# EAGLE design Sedna Power Board v3 (EAGLE 9.6.2)
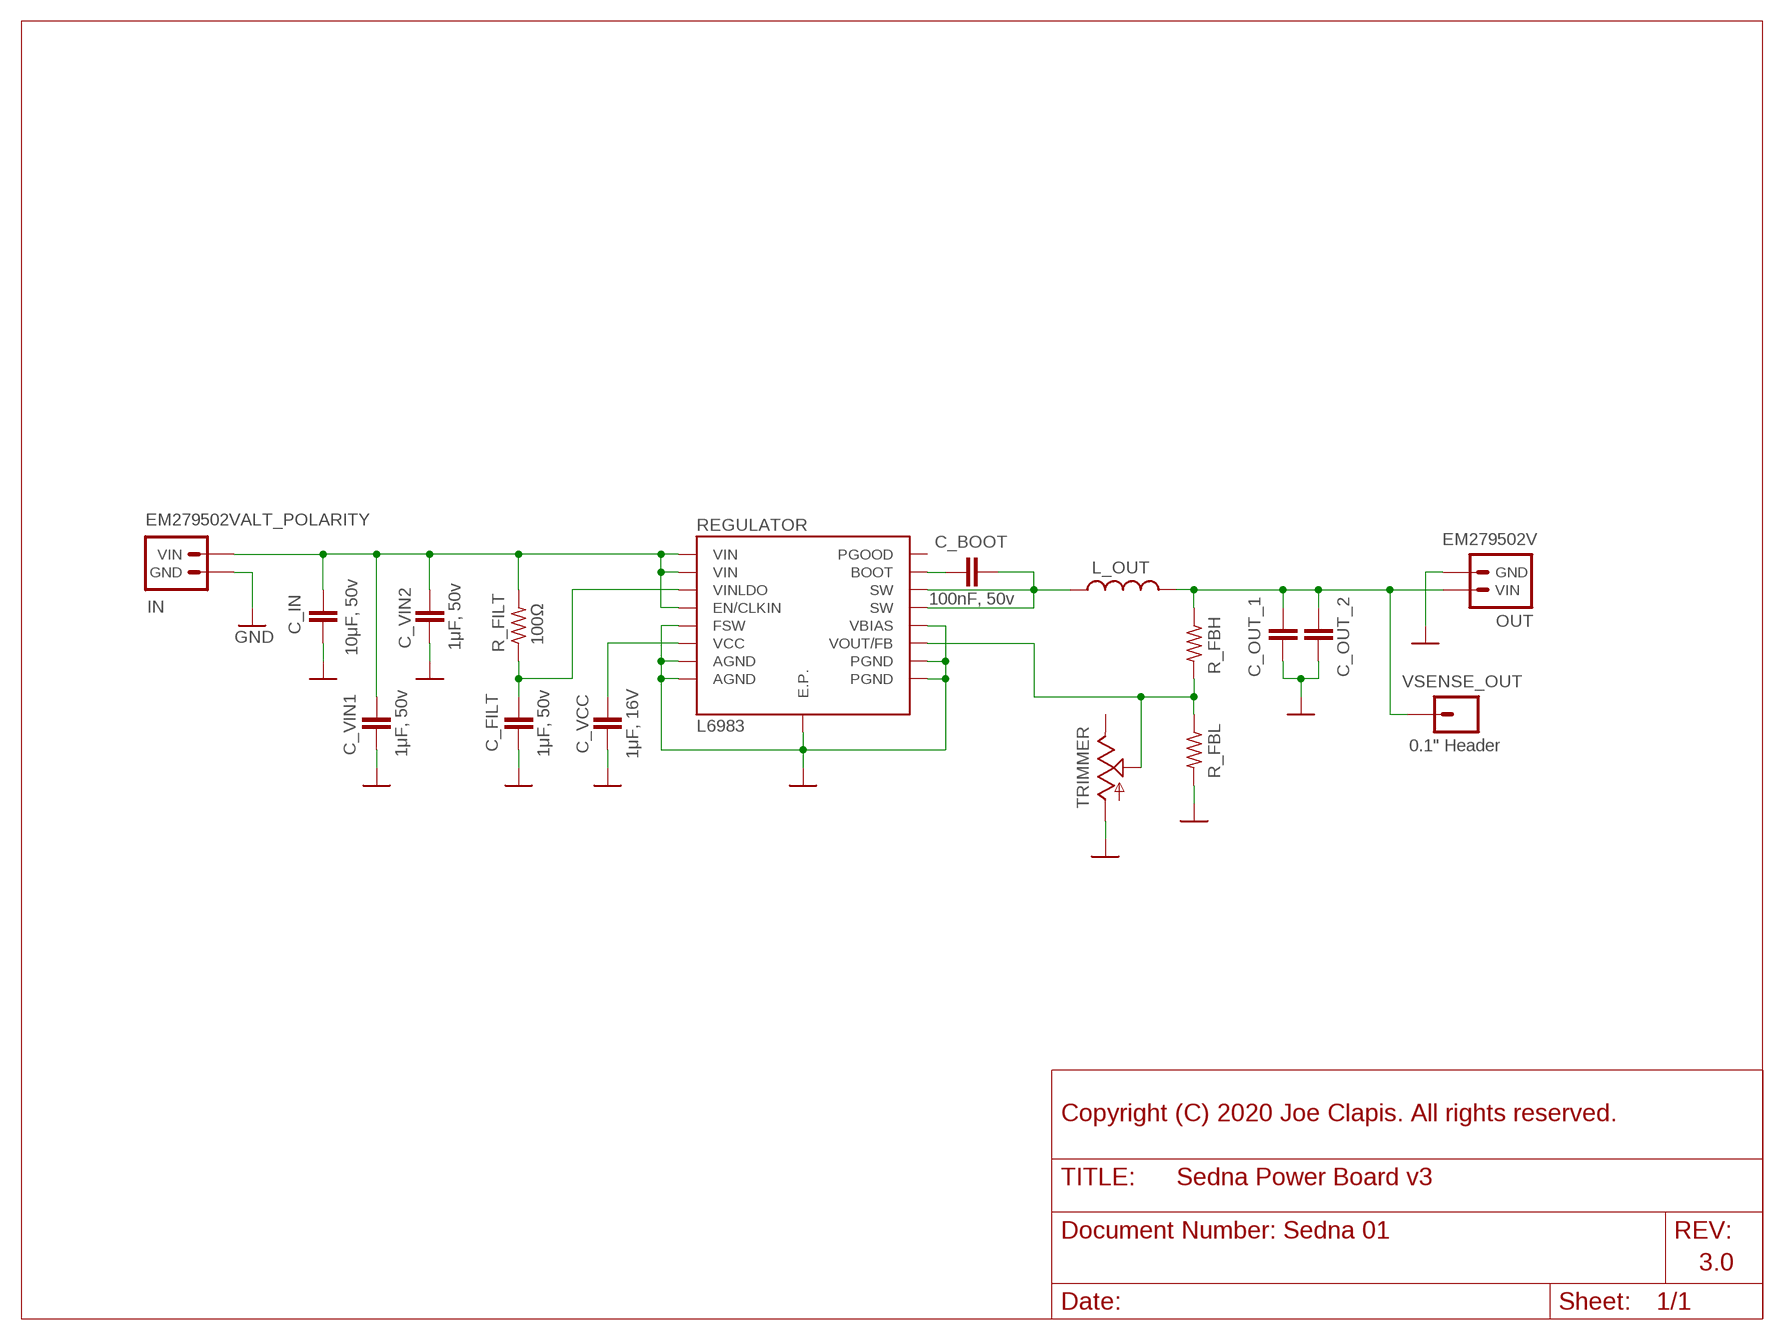
[diagram p0: schematic, sheet 1]

## Parts
C_BOOT  100nF, 50v  C-EUC0805  [C0805]
C_FILT  1μF, 50v  C-EUC0805  [C0805]
C_IN  10μF, 50v  C-EUC1206  [C1206]
C_OUT_1  TDK_C2220_5750  [TDK_C2220_5750]
C_OUT_2  TDK_C2220_5750  [TDK_C2220_5750]
C_VCC  1μF, 16V  C-EUC0805  [C0805]
C_VIN1  1μF, 50v  C-EUC0805  [C0805]
C_VIN2  1μF, 50v  C-EUC0805  [C0805]
IN  EM279502VALT_POLARITY  [EM279502V]
L_OUT  PA4343_FP2  [PA4343_FP2]
OUT  EM279502V  [EM279502V]
R_FBH  R-US_R0805  [R0805]
R_FBL  R-US_R0805  [R0805]
R_FILT  100Ω  R-US_R0805  [R0805]
REGULATOR  L6983  [L6983]
TRIMMER  BOURNS_3361S  [BOURNS_3361S]
VSENSE_OUT  0.1" Header  M01PTH  [1X01]

## Nets
C_BOOT: C_BOOT.1 REGULATOR.11_BOOT(BOOT)
FB: R_FBH.2 R_FBL.1 REGULATOR.7_FB/VOUT(VOUT/FB) TRIMMER.2(S)
GND: C_FILT.2 C_IN.2 C_OUT_1.2 C_OUT_2.2 C_VCC.2 C_VIN1.2 C_VIN2.2 IN.1A(GND) IN.1B(GND) OUT.2A(GND) OUT.2B(GND) R_FBL.2 REGULATOR.3_AGND(AGND) REGULATOR.6_VBIAS(VBIAS) REGULATOR.8_FSW(FSW) REGULATOR.10_AGND(AGND) REGULATOR.13_PGND(PGND) REGULATOR.16_PGND(PGND) REGULATOR.E.P. TRIMMER.1(A)
SW_OUT: C_BOOT.2 L_OUT.1 REGULATOR.14_SW(SW) REGULATOR.15_SW(SW)
V_IN: C_IN.1 C_VIN1.1 C_VIN2.1 IN.2A(VIN) IN.2B(VIN) R_FILT.2 REGULATOR.1_VIN(VIN) REGULATOR.4_EN/CLKIN(EN/CLKIN) REGULATOR.12_VIN(VIN)
V_OUT: C_OUT_1.1 C_OUT_2.1 L_OUT.2 OUT.1A(VIN) OUT.1B(VIN) R_FBH.1 VSENSE_OUT.1
VCC: C_VCC.1 REGULATOR.9_VCC(VCC)
VINLDO: C_FILT.1 R_FILT.1 REGULATOR.2_VINLDO(VINLDO)
Unconnected: REGULATOR.5_PGOOD(PGOOD) TRIMMER.3(E)

## Notes on the sheet
- Copyright (C) 2020 Joe Clapis. All rights reserved.
- Sedna 01
- 3.0

## Library data of the parts
C_BOOT C_FILT C_IN C_VCC C_VIN1 C_VIN2 = rcl:C-EU: CAPACITOR, European symbol; SPICEPREFIX: C
C_OUT_1 C_OUT_2 = Sedna Components:TDK_C2220_5750
IN OUT = Sedna Components:EM279502V
L_OUT = Sedna Components:PA4343_FP2: The Pulse PA4343.XXXNLT is a series of shielded SMT power inductors: https://www.mouser.com/datasheet/2/336/P770-1526930.pdf
R_FBH R_FBL R_FILT = rcl:R-US_: RESISTOR, American symbol; SPICEPREFIX: R
REGULATOR = Sedna Components:L6983: The L6983 is a configurable DC-DC step-down regulator, bringing 3.5-38V down to 0.85-Vin. It supports up to 3A of output current, and comes in a QFN16 package. https://my.st.com/resource/en/datasheet/l6983.pdf; SPICEPREFIX: X
TRIMMER = Sedna Components:BOURNS_3361: The Bourns 3361 <https://www.mouser.com/datasheet/2/54/3361-776949.pdf> is a SMD trimmining potentiometer.
VSENSE_OUT = SparkFun-Connectors:M01: Header 1 Standard 1-pin 0.1" header. Use with straight break away headers (SKU : PRT-00116), right angle break away headers (PRT-00553), swiss pins (PRT-00743), machine pins (PRT-00117), and female headers (PRT-00115). SMTSO-256-ET is a "flush mount" nut for a 4-40 screw. The older package used to be too tight, and did not allow it to sit properly thru the drill hit. The latest (0.165DIA) fits nice and snug.

## Board
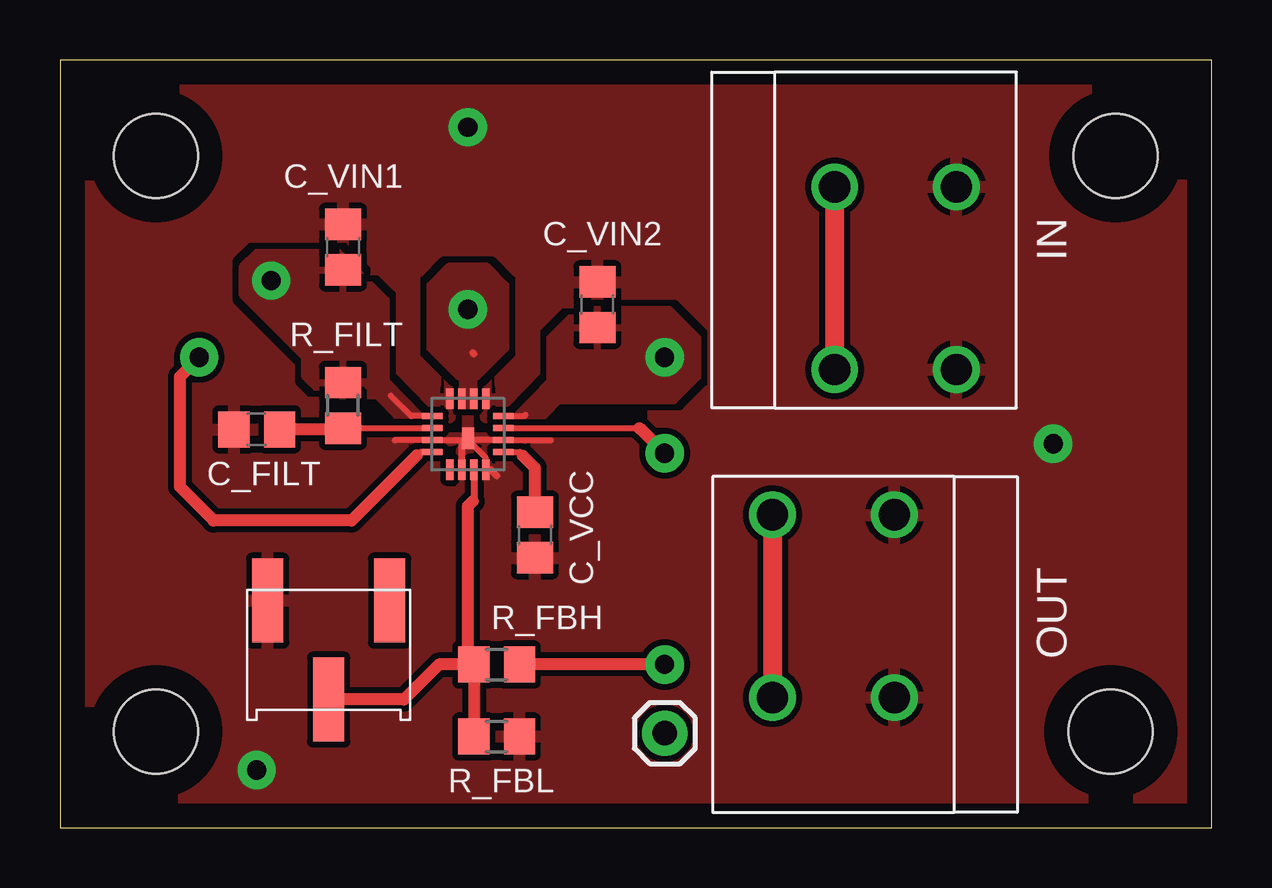
[diagram p1: board, top side]
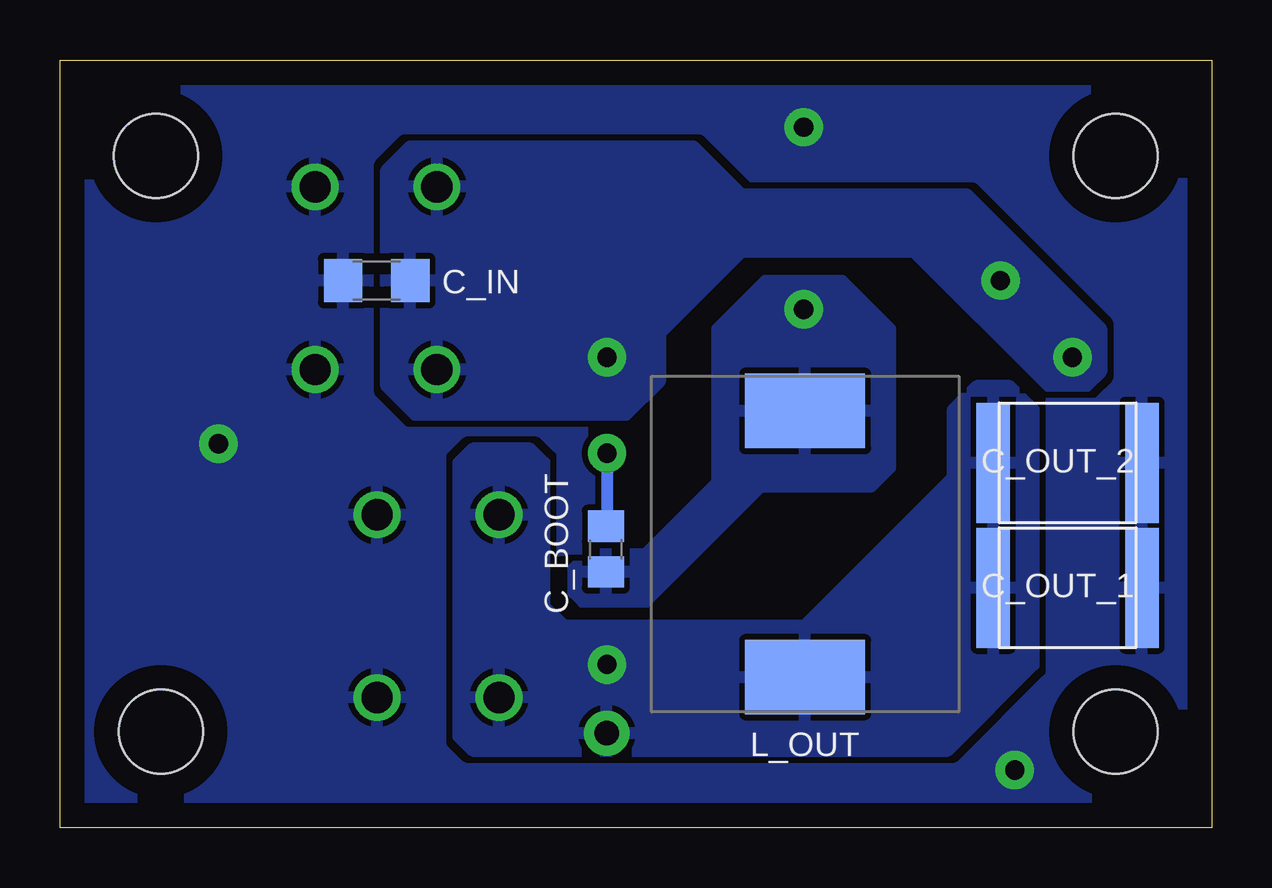
[diagram p2: board, bottom side, seen from below]

Size 48 x 32 mm. Coordinates in mm from the lower left corner, seen from the top.
Outline: 0,0 48,0 48,32 0,32 0,0
Copper layers (1*16): Top 0.035mm / dielectric 1.5mm / Bottom 0.035mm
Design rules "default": minimum track width 6mil, minimum drill 0.35mm, track to track 6mil, track to pad 6mil, pad to pad 6mil, via to via 6mil, smd to smd 6mil, copper to edge 40mil, drill to drill 6mil, minimum pad ring 10mil, minimum via ring 8mil, stop-mask expansion 4mil, vias tented up to drill 0mil, thermal gap 10mil
Holes 3.5 mm at 4,4 4,28 44,28 43.8,4

### Footprints (pad centres in the part's own frame; a part is rotated, then mirrored left to right if it is on the bottom)
C0805 = smd 1.3 x 1.5: 1 -0.95,0; 2 0.95,0
C1206 = smd 1.6 x 1.8: 1 -1.4,0; 2 1.4,0
TDK_C2220_5750 = smd 1.4 x 5: 1 -3.1,0; 2 3.1,0
EM279502V = drill 1.3: 1A -2.54,-3.81; 1B -2.54,3.81; 2A 2.54,-3.81; 2B 2.54,3.81
PA4343_FP2 = smd 5 x 3.1: 1 0,5.55; 2 0,-5.55
R0805 = smd 1.3 x 1.5: 1 -0.95,0; 2 0.95,0
L6983 = smd 0.85 x 0.25: 1_VIN 1.475,-0.75; 2_VINLDO 1.475,-0.25; 3_AGND 1.475,0.25; 4_EN/CLKIN 1.475,0.75; 9_VCC -1.475,0.75; 10_AGND -1.475,0.25; 11_BOOT -1.475,-0.25; 12_VIN -1.475,-0.75 | smd 0.3 x 0.85: 5_PGOOD 0.75,1.475; 6_VBIAS 0.25,1.475; 7_FB/VOUT -0.25,1.475; 8_FSW -0.75,1.475; 13_PGND -0.75,-1.475; 14_SW -0.25,-1.475; 15_SW 0.25,-1.475; 16_PGND 0.75,-1.475 | smd 0.5 x 0.9: E.P. 0,0.17
BOURNS_3361S = smd 1.3 x 3.5: 1 2.54,-2.06; 2 0,2.06; 3 -2.54,-2.06
1X01 = drill 1.016 pad 1.88: 1 0,0

### Placement (x,y rotation side)
C_BOOT  25.25,11.61 270 bottom
C_FILT  8.2,16.6 180 top
C_IN  34.8,22.8 180 bottom
C_OUT_1  6,10 0 bottom
C_OUT_2  6,15.2 0 bottom
C_VCC  19.8,12.2 270 top
C_VIN1  11.8,24.2 90 top
C_VIN2  22.4,21.8 90 top
IN  34.83,22.9 180 top
L_OUT  16.94,11.82 0 bottom
OUT  32.24,9.23 0 top
R_FBH  18.2,6.8 180 top
R_FBL  18.2,3.8 0 top
R_FILT  11.8,17.6 90 top
REGULATOR  17,16.4 180 top
TRIMMER  11.2,7.4 180 top
VSENSE_OUT  25.21,3.93 0 top

### Tracks (layer width: path | path; a pad name or v marks a point on that pad's centre or on a via)
C_BOOT  (via drill 0.8 pad 1.6)
  Top 0.25: REGULATOR.11_BOOT 24.15,16.65
  Top 0.5: 24.15,16.65 v25.2,15.6
  Bottom 0.5: C_BOOT.1 25.2,12.61 v25.2,15.6
FB
  Top 0.3: REGULATOR.7_FB/VOUT 17.25,13.65 17.2,13.6
  Top 0.5: R_FBH.2 R_FBL.1 | R_FBH.2 15.8,6.8 14.34,5.34 TRIMMER.2 | R_FBH.2 17,7.05 17,13.4 17.2,13.6
GND  (via drill 0.8 pad 1.6)
  Top 0.25: 17,16.15 REGULATOR.3_AGND 13.95,16.15 | 17,16.15 17.08,16.15 REGULATOR.10_AGND 20.45,16.15 | REGULATOR.8_FSW 17.75,15.4 17,16.15 | 17,16.15 16.98,16.18
  Top 0.3: 17.08,16.15 REGULATOR.E.P. | 18.2,14.68 17.95,14.93 REGULATOR.8_FSW | REGULATOR.6_VBIAS 16.75,15.95 16.98,16.18
  other vias: 8.2,2.4 17,29.2 41.4,16
  pour Top (isolate 0.25, rank 2): 0,32 0,0 48,0 48,32
  pour Bottom (isolate 0.25, rank 2): 0,32 0,0 48,0 48,32
  pour Top (no thermals): 17.8,15 17.8,14 18.4,14 18.4,15
SW_OUT  (via drill 0.8 pad 1.6)
  Top 0.3: 17.25,19.75 17.2,19.8
  other vias: 17,21.6
  pour Top: 17.8,23.4 16.2,23.4 15.4,22.6 15.4,20 16.6,18.8 17.4,18.8 18.6,20 18.6,22.6
  pour Top (no thermals): 17.25,17.8 17.25,19.6 16.75,19.6 16.75,17.6 17.2,17.6
  pour Bottom (isolate 0.5): 
  pour Bottom: 15.4,22.8 13.4,20.8 13.4,15 14.2,14.2 18.8,14.2 23.6,9.4 26.2,9.4 26.6,9.8 26.6,10.8 26,11.4 23.6,11.4 20.6,14.4 20.6,20.8 18.6,22.8
V_IN  (via drill 0.8 pad 1.6)
  Top 0.25: 19.4,17.2 19.35,17.15 REGULATOR.12_VIN | REGULATOR.1_VIN 14.65,17.15 13.8,18 | REGULATOR.4_EN/CLKIN 15,15.65 14.88,15.53
  Top 0.5: 14.88,15.53 12.15,12.8 6.4,12.8 5,14.2 5,18.8 v5.8,19.6
  Top 0.8: IN.2A IN.2B
  other vias: 8.8,22.8 25.2,19.6
  pour Top (no thermals): 15,17.18 14,17.18 12.64,18.6 13.64,18.6
  pour Top: 20.4,17.8 25.6,17.8 26.6,18.8 26.6,20.4 25.4,21.6 21.6,21.6 20.4,20.4
  pour Top (no thermals): 19.04,17.18 20.2,17.18 21.56,18.6 20.4,18.6
  pour Bottom (isolate 0.5): 4.6,20.8 4.6,19 5.2,18.4 6.8,18.4 12.4,24 19.6,24 23,20.6 23,18.6 24.4,17.2 33.2,17.2 34.4,18.4 34.4,27.4 33.4,28.4 21.6,28.4 19.6,26.4 10.2,26.4
  pour Top: 13.6,18 11,18 10.2,18.8 10.2,19.6 7.6,22.2 7.6,23.4 8.2,24 11.6,24 13.6,22
V_OUT  (via drill 0.8 pad 1.6)
  Top 0.5: v25.2,6.8 R_FBH.1
  Top 0.8: OUT.1B OUT.1A
  pour Bottom (isolate 0.5): 28.4,15.8 30.8,15.8 31.4,15.2 31.4,3.8 30.8,3.2 11,3.2 7.4,6.8 7.4,17.4 8.4,18.4 9.8,18.4 10.8,17.4 10.8,14.6 17,8.4 27,8.4 27.8,9.2 27.8,15.2
VCC
  Top 0.25: REGULATOR.9_VCC 19.15,15.65 | 19.2,15.65 19.15,15.65 | 19.3,15.5 19.15,15.65
  Top 0.5: C_VCC.1 19.8,15 19.3,15.5
VINLDO
  Top 0.25: R_FILT.1 REGULATOR.2_VINLDO
  Top 0.5: R_FILT.1 11.75,16.6 C_FILT.1

### Text on the board
tDocu: + | - | Sedna Power / Board v3.0